# Altium project CanNode.PrjPcb
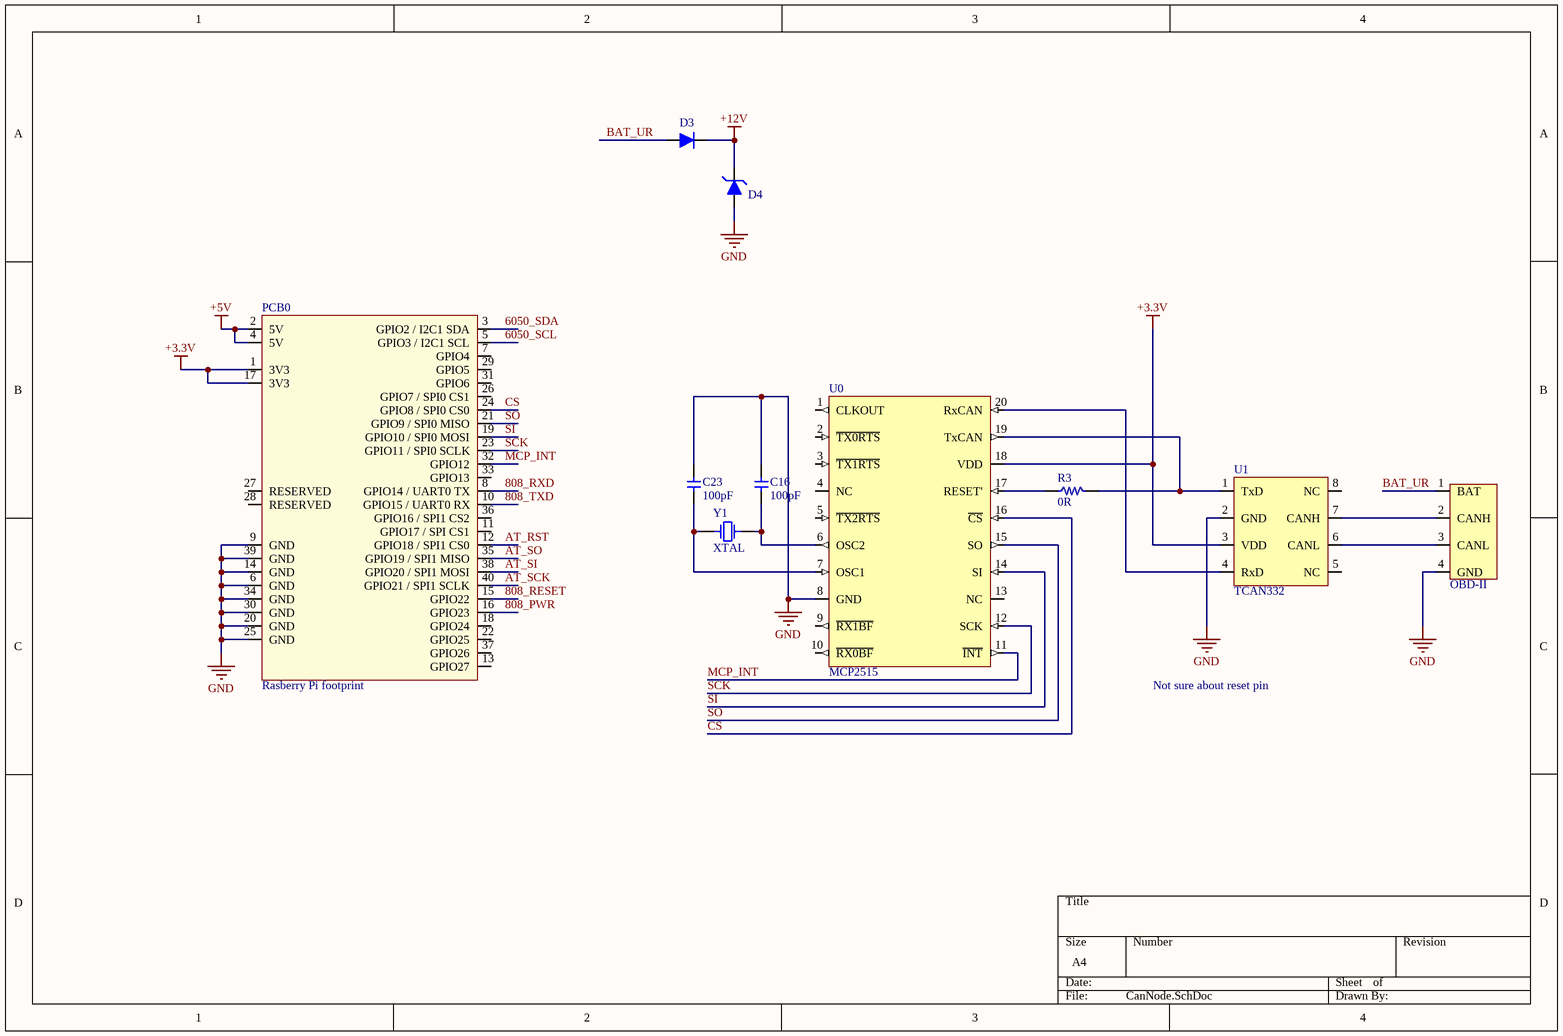
[diagram p0: CanNode.SchDoc]
6 sheets, 72 parts. Net scope: global (net labels, ports and power ports of the same name join across sheets).
Board files: mainPCB_24V.PcbDoc, mainPCB.PcbDoc
Sheets:
  CanNode.SchDoc
  MPU6050.SchDoc
  SIM808.SchDoc
  ATtiny.SchDoc
  bmp280_i2c.SchDoc
  PowerCircuit_24V.SchDoc

## Sheet CanNode.SchDoc
size A4

### Parts
C16  value 100pF  [0805]  (hidden comment: Generic Capacitor)
C23  value 100pF  [0805]  (hidden comment: Generic Capacitor)
D3  RSX301L-30TE25  [SMA_diode]  (value not drawn)
D4  TVS Diode  [TVS Diode 15]  (value not drawn)
OBD-II  OBD-II  [OBD_II]  (value not drawn)
PCB0  Rasberry Pi footprint  [Rasberry PI]
R3  value 0R  [0805]  (hidden comment: Resistor)
U0  MCP2515  Notes: Not sure about reset pin  [MCP2515]
U1  TCAN332  [SOIC-8]
Y1  XTAL  [XTAL-16.000]

### Nets
+3.3V: PCB0.1(3V3) PCB0.17(3V3) U0.18(VDD) U1.3(VDD)
+5V: PCB0.2(5V) PCB0.4(5V)
+12V: D3.2 D4.2
GND: C16.2 C23.2 D4.1 OBD-II.4(GND) PCB0.6(GND) PCB0.9(GND) PCB0.14(GND) PCB0.20(GND) PCB0.25(GND) PCB0.30(GND) PCB0.34(GND) PCB0.39(GND) U0.8(GND) U1.2(GND)
808_PWR: PCB0.16(GPIO23)
808_RESET: PCB0.15(GPIO22)
808_RXD: PCB0.8(GPIO14_/_UART0_TX)
808_TXD: PCB0.10(GPIO15_/_UART0_RX)
6050_SCL: PCB0.5(GPIO3_/_I2C1_SCL)
6050_SDA: PCB0.3(GPIO2_/_I2C1_SDA)
AT_RST: PCB0.12(GPIO18_/_SPI1_CS0)
AT_SCK: PCB0.40(GPIO21_/_SPI1_SCLK)
AT_SI: PCB0.38(GPIO20_/_SPI1_MOSI)
AT_SO: PCB0.35(GPIO19_/_SPI1_MISO)
BAT_UR: D3.1 OBD-II.1(BAT)
CS: PCB0.24(GPIO8_/_SPI0_CS0) U0.16(~{CS})
MCP_INT: PCB0.32(GPIO12) U0.11(~{INT})
SCK: PCB0.23(GPIO11_/_SPI0_SCLK) U0.12(SCK)
SI: PCB0.19(GPIO10_/_SPI0_MOSI) U0.14(SI)
SO: PCB0.21(GPIO9_/_SPI0_MISO) U0.15(SO)
NetC16_1: C16.1 U0.6(OSC2) Y1.1
NetC23_1: C23.1 U0.7(OSC1) Y1.0
NetOBD-II_2: OBD-II.2(CANH) U1.7(CANH)
NetOBD-II_3: OBD-II.3(CANL) U1.6(CANL)
NetR3_1: R3.1 U0.17(RESET')
NetR3_2: R3.2 U0.19(TxCAN) U1.1(TxD)
NetU0_20: U0.20(RxCAN) U1.4(RxD)

Not connected (* = marked no-connect by the designer): PCB0 7(GPIO4) 11(GPIO17_/_SPI_CS1) 13(GPIO27) 18(GPIO24) 22(GPIO25) 26(GPIO7_/_SPI0_CS1) 27(RESERVED) 28(RESERVED) 29(GPIO5) 31(GPIO6) 33(GPIO13) 36(GPIO16_/_SPI1_CS2) 37(GPIO26); U0 1(CLKOUT) 2(~{TX0RTS}) 3(~{TX1RTS}) 4(NC) 5(~{TX2RTS}) 9(~{RX1BF}) 10(~{RX0BF}) 13(NC); U1 5(NC) 8(NC)

### Library data of the parts
C16 C23 = Capacitor
D3 = RSX301L-30TE25: DIODE SCHOTTKY 30V 3A; Supplier: DigiKey; Supplier PN: RSX301L-30TE25CT-ND
D4 = SMBJ15D-M3/H: TVS DIODE 15VWM 24VC DO214AA; Manufacturer: Vishay Semiconductor Diodes Division; Type: Zener; Unidirectional Channels: 1; Voltage - Reverse Standoff (Typ): 15V; Voltage - Breakdown (Min): 17V; Voltage - Clamping (Max) @ Ipp: 24V; Current - Peak Pulse (10/1000µs): 25A; Power - Peak Pulse: 600W; Power Line Protection: No; Supplier 1: Digi-Key; Manufacturer Part Number: SMBJ15D-M3/H; Pricing 1: 1=0.51, 10=0.42, 25=0.3832, 100=0.2853, 250=0.25852 (CAD); Packaging: Cut Tape (CT); Part Status: Active; Bidirectional Channels: -; Applications: General Purpose; Capacitance @ Frequency: -; Operating Temperature: -55°C ~ 150°C (TJ); Mounting Type: Surface Mount; Package / Case: DO-214AA, SMB; Supplier Device Package: DO-214AA (SMBJ); ComponentLink1URL: http://www.vishay.com/docs/87606/87606.pdf; ComponentLink1Description: http://www.vishay.com/docs/87606/87606.pdf; Supplier Part Number 1: SMBJ15D-M3/HGICT-ND
PCB0 = Rasberry Pi
R3 = Resistor: Generic Resistor
U0 = MCP2515: IC CAN CTLR W/SPI 2.0B 20-QFN; Mfr 1: Microchip Technology; Digi-Key Part Number: MCP2515T-I/MLCT-ND
U1 = TCAN332: IC TXRX CAN 8SOIC; Mfr 1: Texas Instruments; Digi-Key Part Number: 296-43711-1-ND
Y1 = XTAL-16.000: XTAL16.0000MHZ 18PF SMD; Manufacturer: Abracon LLC; Manufacturer Part Number: ABM7-16.000MHZ-D2Y-T; Frequency: 16MHz; Frequency Stability: ±30ppm; Frequency Tolerance: ±20ppm; ESR (Equivalent Series Resistance): 50 Ohm; Operating Mode: Fundamental; Supplier 1: Digi-Key; Pricing 1: 1=1.12, 10=0.989, 50=0.9234, 100=0.8162, 500=0.77322 (CAD); Packaging: Cut Tape (CT); Part Status: Active; Type: MHz Crystal; Load Capacitance: 18pF; Operating Temperature: -40°C ~ 85°C; Ratings: -; Mounting Type: Surface Mount; Package / Case: 2-SMD, No Lead; Size / Dimension: 0.236" L x 0.138" W (6.00mm x 3.50mm); Height - Seated (Max): 0.055" (1.40mm); ComponentLink1URL: http://www.abracon.com/Resonators/abm7.pdf; ComponentLink1Description: http://www.abracon.com/Resonators/abm7.pdf; Supplier Part Number 1: 535-9840-1-ND

## Sheet MPU6050.SchDoc
size A4
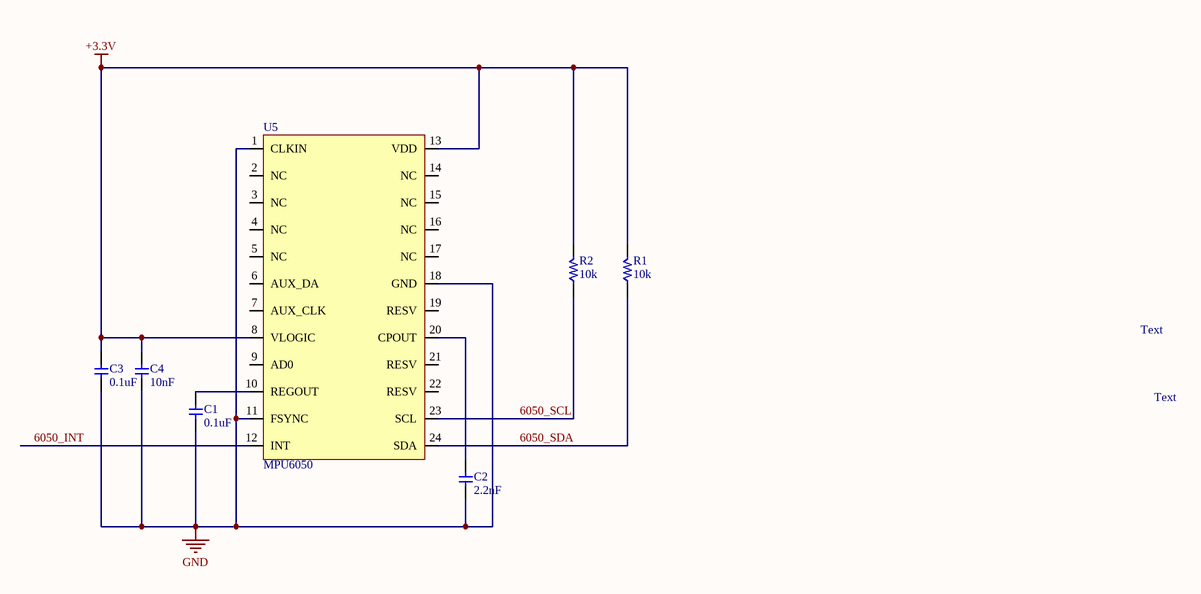
[diagram p1: MPU6050.SchDoc]

### Parts
C1  value 0.1uF  [0805]  (hidden comment: Generic Capacitor)
C2  value 2.2nF  [0805]  (hidden comment: Generic Capacitor)
C3  value 0.1uF  [0805]  (hidden comment: Generic Capacitor)
C4  value 10nF  [0805]  (hidden comment: Generic Capacitor)
R1  value 10k  [0805]  (hidden comment: Resistor)
R2  value 10k  [0805]  (hidden comment: Resistor)
U5  MPU6050  [MPU-6050]

### Nets
+3.3V: C3.1 C4.2 R1.2 R2.2 U5.8(VLOGIC) U5.13(VDD)
GND: C1.1 C2.1 C3.2 C4.1 U5.1(CLKIN) U5.11(FSYNC) U5.18(GND)
6050_INT: U5.12(INT)
6050_SCL: R2.1 U5.23(SCL)
6050_SDA: R1.1 U5.24(SDA)
NetC1_2: C1.2 U5.10(REGOUT)
NetC2_2: C2.2 U5.20(CPOUT)

Not connected (* = marked no-connect by the designer): U5 2(NC) 3(NC) 4(NC) 5(NC) 6(AUX_DA) 7(AUX_CLK) 9(AD0) 14(NC) 15(NC) 16(NC) 17(NC) 19(RESV) 21(RESV) 22(RESV)

### Notes on the sheet
- Text

### Library data of the parts
C1-C4 = Capacitor
R1 R2 = Resistor: Generic Resistor
U5 = MPU6050: IMU ACCEL/GYRO 3-AXIS I2C 24QFN; Notes: *

## Sheet SIM808.SchDoc
size A4
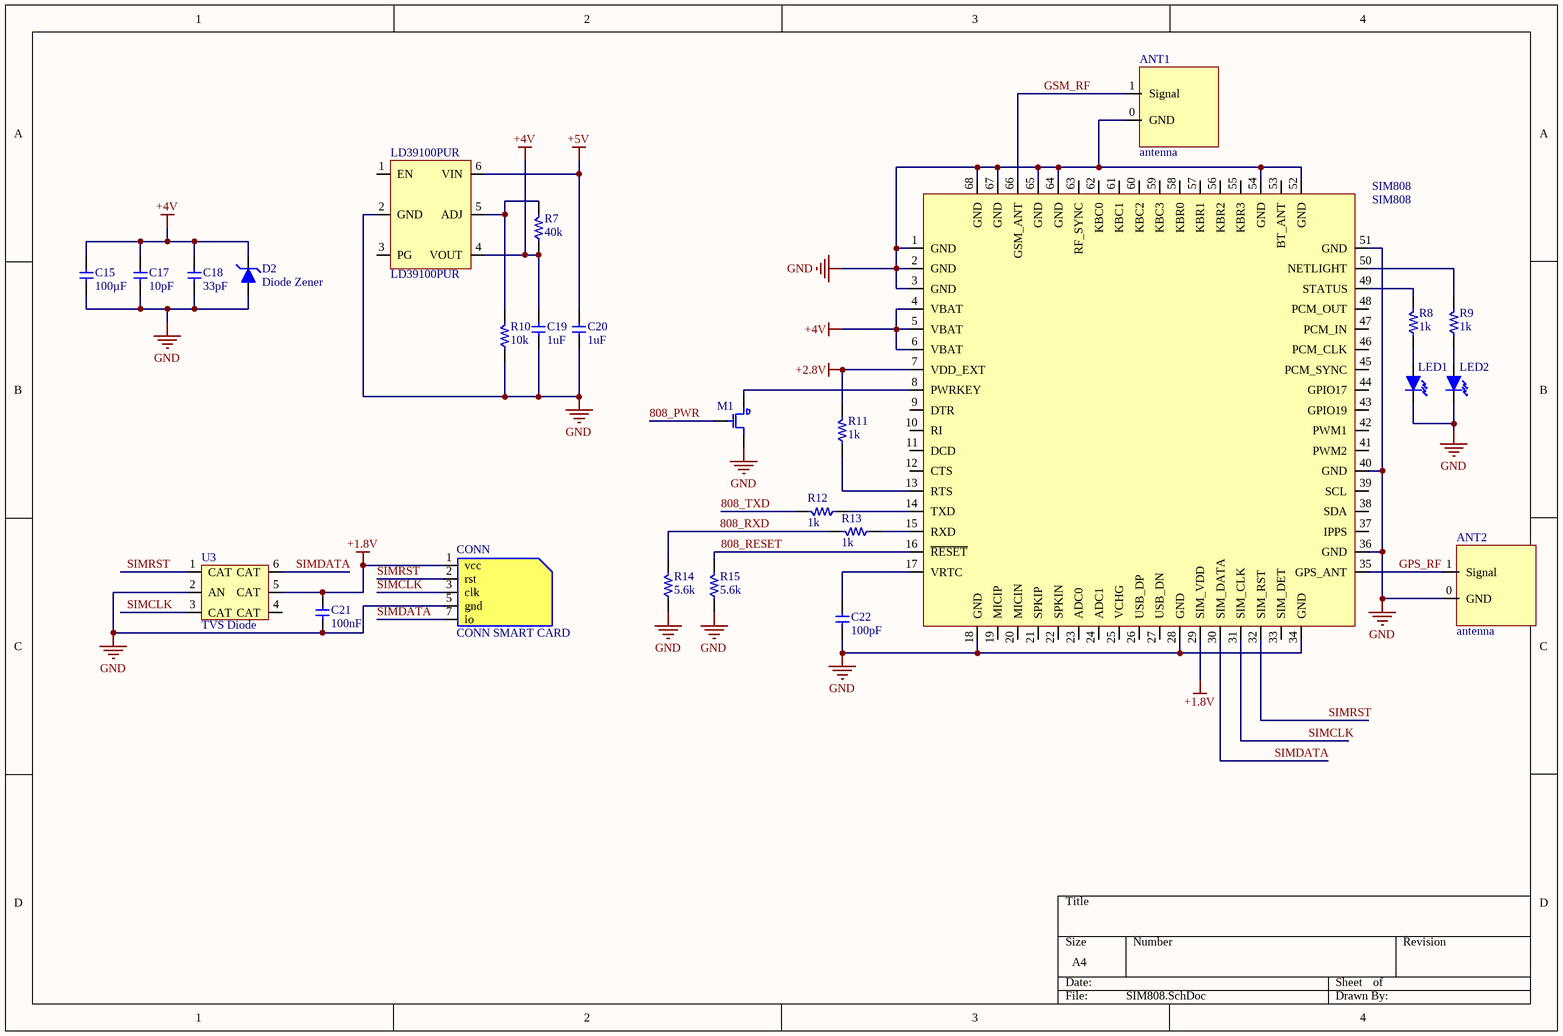
[diagram p2: SIM808.SchDoc]

### Parts
ANT1  antenna  [uFL]
ANT2  antenna  [uFL]
C15  Capacitance: 100µF  [Cap 1210]  (hidden comment: Cap Cer 100uF)
C17  value 10pF  [0805]  (hidden comment: Generic Capacitor)
C18  value 33pF  [0805]  (hidden comment: Generic Capacitor)
C19  value 1uF  [0805]  (hidden comment: Generic Capacitor)
C20  value 1uF  [0805]  (hidden comment: Generic Capacitor)
C21  value 100nF  [0805]  (hidden comment: Generic Capacitor)
C22  value 100pF  [0805]  (hidden comment: Generic Capacitor)
CONN  CONN SMART CARD  [CONN SMART CARD]
D2  Diode Zener  [Diode Zener]
LD39100PUR  LD39100PUR  [LD39100PUR]
LED1  Led Red  [0805 LED]  (value not drawn)
LED2  Led Green  [0805 LED]  (value not drawn)
M1  N-CH Mosfet Switch  [SOT32-3]  (value not drawn)
R7  value 40k  [0805]  (hidden comment: Resistor)
R8  value 1k  [0805]  (hidden comment: Resistor)
R9  value 1k  [0805]  (hidden comment: Resistor)
R10  value 10k  [0805]  (hidden comment: Resistor)
R11  value 1k  [0805]  (hidden comment: Resistor)
R12  value 1k  [0805]  (hidden comment: Resistor)
R13  value 1k  [0805]  (hidden comment: Resistor)
R14  value 5.6k  [0805]  (hidden comment: Resistor)
R15  value 5.6k  [0805]  (hidden comment: Resistor)
SIM808  SIM808  [SIM808]
U3  TVS Diode  [SMF05CT2G]

### Nets
+1.8V: C21.1 CONN.1(vcc) SIM808.29(SIM_VDD) U3.5(CAT)
+2.8V: R11.2 SIM808.7(VDD_EXT)
+4V: C15.1 C17.1 C18.1 C19.2 D2.1 LD39100PUR.4(VOUT) R7.1 SIM808.4(VBAT) SIM808.5(VBAT) SIM808.6(VBAT)
+5V: C20.1 LD39100PUR.6(VIN)
GND: ANT1.0(GND) ANT2.0(GND) C15.2 C17.2 C18.2 C19.1 C20.2 C21.2 C22.2 CONN.5(gnd) D2.2 LD39100PUR.2(GND) LED1.1 LED2.1 M1.2(S) R10.1 R14.1 R15.1 SIM808.1(GND) SIM808.2(GND) SIM808.3(GND) SIM808.18(GND) SIM808.28(GND) SIM808.34(GND) SIM808.36(GND) SIM808.40(GND) SIM808.51(GND) SIM808.52(GND) SIM808.54(GND) SIM808.64(GND) SIM808.65(GND) SIM808.67(GND) SIM808.68(GND) U3.2(AN)
808_PWR: M1.1(G)
808_RESET: R15.2 SIM808.16(~{RESET})
808_RXD: R13.2 R14.2
808_TXD: R12.2
GPS_RF: ANT2.1(Signal) SIM808.35(GPS_ANT)
GSM_RF: ANT1.1(Signal) SIM808.66(GSM_ANT)
SIMCLK: CONN.3(clk) SIM808.31(SIM_CLK) U3.3(CAT)
SIMDATA: CONN.7(io) SIM808.30(SIM_DATA) U3.6(CAT)
SIMRST: CONN.2(rst) SIM808.32(SIM_RST) U3.1(CAT)
NetC22_1: C22.1 SIM808.17(VRTC)
NetLD39100PUR_5: LD39100PUR.5(ADJ) R7.2 R10.2
NetLED1_2: LED1.2 R8.1
NetLED2_2: LED2.2 R9.1
NetM1_3: M1.3(D) SIM808.8(PWRKEY)
NetR8_2: R8.2 SIM808.49(STATUS)
NetR9_2: R9.2 SIM808.50(NETLIGHT)
NetR11_1: R11.1 SIM808.13(RTS)
NetR12_1: R12.1 SIM808.14(TXD)
NetR13_1: R13.1 SIM808.15(RXD)

Not connected (* = marked no-connect by the designer): LD39100PUR 1(EN) 3(PG); SIM808 9(DTR) 10(RI) 11(DCD) 12(CTS) 19(MICIP) 20(MICIN) 21(SPKIP) 22(SPKIN) 23(ADC0) 24(ADC1) 25(VCHG) 26(USB_DP) 27(USB_DN) 33(SIM_DET) 37(IPPS) 38(SDA) 39(SCL) 41(PWM2) 42(PWM1) 43(GPIO19) 44(GPIO17) 45(PCM_SYNC) 46(PCM_CLK) 47(PCM_IN) 48(PCM_OUT) 53(BT_ANT) 55(KBR3) 56(KBR2) 57(KBR1) 58(KBR0) 59(KBC3) 60(KBC2) 61(KBC1) 62(KBC0) 63(RF_SYNC); U3 4(CAT)

### Library data of the parts
ANT1 ANT2 = antenna: uFL SMT Antenna Connector; mfr: adafruit; supplier: https://www.adafruit.com/product/1661
C15 = LMK325ABJ107MM-P: CAP CER 100UF 10V X5R 1210; Manufacturer: Taiyo Yuden; Tolerance: ±20%; Supplier 1: Digi-Key; Manufacturer Part Number: LMK325ABJ107MM-P; Pricing 1: 1=1.55, 10=1.231, 25=1.1284, 50=1.0668, 100=0.9231, 250=0.82052, 500=0.69746 (CAD); Packaging: Cut Tape (CT); Part Status: Active; Voltage - Rated: 10V; Temperature Coefficient: X5R; Operating Temperature: -55°C ~ 85°C; Features: -; Ratings: -; Applications: General Purpose; Mounting Type: Surface Mount, MLCC; Package / Case: 1210 (3225 Metric); Size / Dimension: 0.126" L x 0.098" W (3.20mm x 2.50mm); Height - Seated (Max): -; Thickness (Max): 0.110" (2.80mm); Lead Spacing: -; Lead Style: -; ComponentLink1URL: http://ds.yuden.co.jp/TYCOMPAS/ut/detail.do?productNo=LMK325ABJ107MM-P&fileName=LMK325ABJ107MM-P_SS&mode=specSheetDownload; ComponentLink1Description: http://ds.yuden.co.jp/TYCOMPAS/ut/detail.do?productNo=LMK325ABJ107MM-P&fileName=LMK325ABJ107MM-P_SS&mode=specSheetDownload; Supplier Part Number 1: 587-4317-1-ND
C17-C22 = Capacitor
CONN = CONN SMART CARD: Manufacturer: Wurth Electronics Inc; Manufacturer Part Number: 693022010811; Card Type: Micro SIM; Number of Positions: 8; Connector Type: Connector and Ejector; Insertion, Removal Method: Hinged Lid; Supplier 1: Digi-Key; Pricing 1: 1=2.6, 10=2.384, 50=2.2076, 100=2.0317, 500=1.76614 (CAD); Packaging: Cut Tape (CT); Part Status: Active; Ejector Side: -; Mounting Type: Surface Mount, Right Angle; Features: Shielded; Height Above Board: 0.077" (1.95mm); Mounting Feature: Normal, Standard - Top; Contact Finish: Gold; Contact Finish Thickness: -; ComponentLink1URL: http://katalog.we-online.de/em/datasheet/693022010811.pdf; ComponentLink1Description: http://katalog.we-online.de/em/datasheet/693022010811.pdf; Supplier Part Number 1: 732-5957-1-ND
D2 = MMSZ5231BT1G: DIODE ZENER 5.1V 500MW SOD123; Manufacturer: ON Semiconductor; Tolerance: ±5%; Impedance (Max) (Zzt): 17 Ohm; Current - Reverse Leakage @ Vr: 5µA @ 2V; Voltage - Forward (Vf) (Max) @ If: 900mV @ 10mA; Supplier 1: Digi-Key; Manufacturer Part Number: MMSZ5231BT1G; Pricing 1: 1=0.34, 10=0.282, 100=0.149, 500=0.09802, 1000=0.06666 (CAD); Packaging: Cut Tape (CT); Part Status: Active; Voltage - Zener (Nom) (Vz): 5.1V; Power - Max: 500mW; Operating Temperature: -55°C ~ 150°C; Mounting Type: Surface Mount; Package / Case: SOD-123; Supplier Device Package: SOD-123; ComponentLink1URL: http://www.onsemi.com/pub_link/Collateral/MMSZ5221BT1-D.PDF; ComponentLink1Description: http://www.onsemi.com/pub_link/Collateral/MMSZ5221BT1-D.PDF; Supplier Part Number 1: MMSZ5231BT1GOSCT-ND
LD39100PUR = LD39100PUR: Adjustable linear voltage regulator; mfr: ST; supplier: http://www.digikey.ca/product-detail/en/stmicroelectronics/LD39100PUR/497-11013-1-ND/2524221
LED1 = LTST-C171EKT: LED RED CLEAR 0805 SMD; Manufacturer: Lite-On Inc.; Lens Color: Colorless; Millicandela Rating: 6mcd; Lens Style/Size: Rectangle with Flat Top, 1.40mm x 1.25mm; Voltage - Forward (Vf) (Typ): 2V; Current - Test: 20mA; Viewing Angle: 130°; Wavelength - Dominant: 621nm; Wavelength - Peak: 630nm; Supplier 1: Digi-Key; Manufacturer Part Number: LTST-C171EKT; Pricing 1: 1=0.48, 10=0.351, 25=0.2588, 100=0.1848, 250=0.12564, 500=0.11086, 1000=0.08684 (CAD); Packaging: Cut Tape (CT); Part Status: Active; Color: Red; Lens Transparency: Clear; Mounting Type: Surface Mount; Features: -; Package / Case: 0805 (2012 Metric); Supplier Device Package: Chip LED; Size / Dimension: 2.00mm L x 1.25mm W; Height (Max): 0.80mm; ComponentLink1URL: http://media.digikey.com/pdf/Data%20Sheets/Lite-On%20PDFs/LTST-C171EKT.pdf; ComponentLink1Description: http://media.digikey.com/pdf/Data%20Sheets/Lite-On%20PDFs/LTST-C171EKT.pdf; Supplier Part Number 1: 160-1422-1-ND
LED2 = LTST-C170GKT: LED GREEN CLEAR 0805 SMD; Manufacturer: Lite-On Inc.; Lens Color: Colorless; Millicandela Rating: 6mcd; Lens Style/Size: Rectangle with Flat Top, 1.40mm x 1.25mm; Voltage - Forward (Vf) (Typ): 2.1V; Current - Test: 10mA; Viewing Angle: 130°; Wavelength - Dominant: 569nm; Wavelength - Peak: 565nm; Supplier 1: Digi-Key; Manufacturer Part Number: LTST-C170GKT; Pricing 1: 1=0.48, 10=0.351, 25=0.2588, 100=0.1848, 250=0.12564, 500=0.11086, 1000=0.08684 (CAD); Packaging: Cut Tape (CT); Part Status: Active; Color: Green; Lens Transparency: Clear; Mounting Type: Surface Mount; Features: -; Package / Case: 0805 (2012 Metric); Supplier Device Package: -; Size / Dimension: 2.00mm L x 1.25mm W; Height (Max): 1.10mm; ComponentLink1URL: http://media.digikey.com/pdf/Data%20Sheets/Lite-On%20PDFs/LTST-C170GKT.pdf; ComponentLink1Description: http://media.digikey.com/pdf/Data%20Sheets/Lite-On%20PDFs/LTST-C170GKT.pdf; Supplier Part Number 1: 160-1179-1-ND
M1 = BSH105,215: MOSFET N-CH 20V 1.05A SOT23; Manufacturer: NXP USA Inc.; FET Type: N-Channel; Current - Continuous Drain (Id) @ 25°C: 1.05A (Ta); Drive Voltage (Max Rds On,  Min Rds On): 1.8V, 4.5V; Vgs(th) (Max) @ Id: 570mV @ 1mA; Gate Charge (Qg) (Max) @ Vgs: 3.9nC @ 4.5V; Input Capacitance (Ciss) (Max) @ Vds: 152pF @ 16V; Vgs (Max): ±8V; Power Dissipation (Max): 417mW (Ta); Rds On (Max) @ Id, Vgs: 200 mOhm @ 600mA, 4.5V; Supplier 1: Digi-Key; Manufacturer Part Number: BSH105,215; Pricing 1: 1=0.53, 10=0.425, 100=0.2902, 500=0.21758, 1000=0.16318 (CAD); Packaging: Cut Tape (CT); Part Status: Active; Technology: MOSFET (Metal Oxide); Drain to Source Voltage (Vdss): 20V; FET Feature: -; Operating Temperature: -55°C ~ 150°C (TJ); Mounting Type: Surface Mount; Supplier Device Package: TO-236AB (SOT23); Package / Case: TO-236-3, SC-59, SOT-23-3; ComponentLink1URL: http://www.nxp.com/documents/data_sheet/BSH105.pdf; ComponentLink1Description: http://www.nxp.com/documents/data_sheet/BSH105.pdf; Supplier Part Number 1: 568-6215-1-ND
R7-R15 = Resistor: Generic Resistor
SIM808 = SIM808: SIM808 GSM + GPRS + GPS Cellular Module; Mfr: SimCom; Supplier: http://www.ebay.ca/itm/291879777454?_trksid=p2057872.m2749.l2649&ssPageName=STRK%3AMEBIDX%3AIT
U3 = SMF05CT2G: TVS DIODE 5VWM 12.5VC SOT363; Manufacturer: ON Semiconductor; Unidirectional Channels: 5; Voltage - Reverse Standoff (Typ): 5V (Max); Voltage - Breakdown (Min): 6.2V; Voltage - Clamping (Max) @ Ipp: 12.5V; Current - Peak Pulse (10/1000µs): 8A (8/20µs); Power - Peak Pulse: 100W; Power Line Protection: No; Capacitance @ Frequency: 80pF @ 1MHz; Supplier 1: Digi-Key; Manufacturer Part Number: SMF05CT2G; Pricing 1: 1=0.53, 10=0.424, 100=0.2891, 500=0.21684, 1000=0.16262 (CAD); Packaging: Cut Tape (CT); Part Status: Active; Type: Zener; Bidirectional Channels: -; Applications: Automotive; Operating Temperature: -40°C ~ 125°C (TJ); Mounting Type: Surface Mount; Package / Case: 6-TSSOP, SC-88, SOT-363; Supplier Device Package: SC-88/SC70-6/SOT-363; ComponentLink1URL: http://www.onsemi.com/pub_link/Collateral/SMF05C-D.PDF; ComponentLink1Description: http://www.onsemi.com/pub_link/Collateral/SMF05C-D.PDF; Supplier Part Number 1: SMF05CT2GOSCT-ND

## Sheet ATtiny.SchDoc
size A4
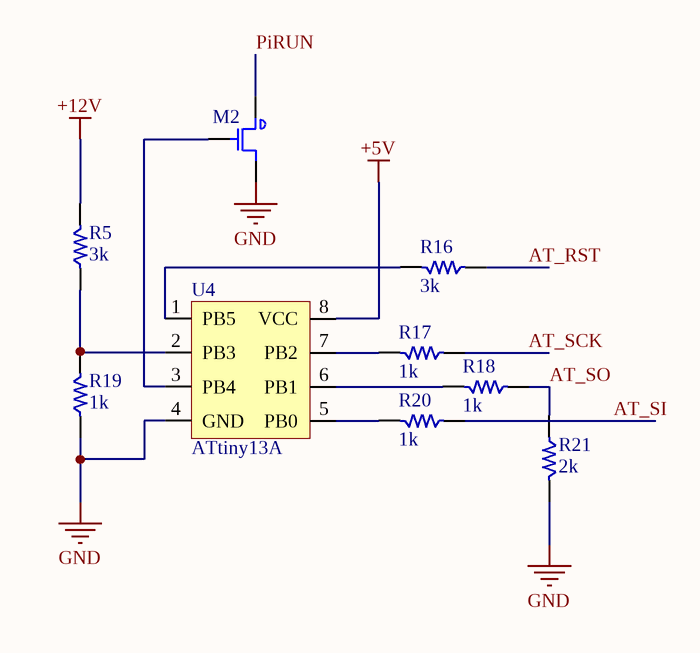
[diagram p3: ATtiny.SchDoc]

### Parts
M2  N-CH Mosfet Switch  [SOT32-3]  (value not drawn)
R5  value 3k  [0805]  (hidden comment: Resistor)
R16  value 3k  [0805]  (hidden comment: Resistor)
R17  value 1k  [0805]  (hidden comment: Resistor)
R18  value 1k  [0805]  (hidden comment: Resistor)
R19  value 1k  [0805]  (hidden comment: Resistor)
R20  value 1k  [0805]  (hidden comment: Resistor)
R21  value 2k  [0805]  (hidden comment: Resistor)
U4  ATtiny13A  [ATtiny13A]

### Nets
+5V: U4.8(VCC)
+12V: R5.2
GND: M2.2(S) R19.1 R21.2 U4.4(GND)
AT_RST: R16.1
AT_SCK: R17.1
AT_SI: R20.1
AT_SO: R18.1 R21.1
PiRUN: M2.3(D)
NetM2_1: M2.1(G) U4.3(PB4)
NetR5_1: R5.1 R19.2 U4.2(PB3)
NetR16_2: R16.2 U4.1(PB5)
NetR17_2: R17.2 U4.7(PB2)
NetR18_2: R18.2 U4.6(PB1)
NetR20_2: R20.2 U4.5(PB0)

### Library data of the parts
M2 = BSH105,215: as M1 on sheet SIM808; Supplier 1: Digi-Key; Manufacturer Part Number: BSH105,215; Pricing 1: 1=0.53, 10=0.425, 100=0.2902, 500=0.21758, 1000=0.16318 (CAD); Packaging: Cut Tape (CT); Part Status: Active; Technology: MOSFET (Metal Oxide); Drain to Source Voltage (Vdss): 20V; FET Feature: -; Operating Temperature: -55°C ~ 150°C (TJ); Mounting Type: Surface Mount; Supplier Device Package: TO-236AB (SOT23); Package / Case: TO-236-3, SC-59, SOT-23-3; ComponentLink1URL: http://www.nxp.com/documents/data_sheet/BSH105.pdf; ComponentLink1Description: http://www.nxp.com/documents/data_sheet/BSH105.pdf; Supplier Part Number 1: 568-6215-1-ND
R5 R16-R21 = Resistor: Generic Resistor
U4 = ATtiny13A: Manufacturer: Microchip Technology; Manufacturer Part Number: ATTINY13A-SSU; Core Processor: AVR; Core Size: 8-Bit; Speed: 20MHz; Peripherals: Brown-out Detect/Reset, POR, PWM, WDT; Number of I/O: 6; Program Memory Size: 1KB (512 x 16); Program Memory Type: FLASH; EEPROM Size: 64 x 8; Voltage - Supply (Vcc/Vdd): 1.8 V ~ 5.5 V; Data Converters: A/D 4x10b; Oscillator Type: Internal; Supplier 1: Digi-Key; Pricing 1: 1=0.89, 25=0.8096, 100=0.7319 (CAD); Packaging: Tube; Part Status: Active; Connectivity: -; RAM Size: 64 x 8; Operating Temperature: -40°C ~ 85°C (TA); Package / Case: 8-SOIC (0.154", 3.90mm Width); Supplier Device Package: 8-SOIC; ComponentLink1URL: http://ww1.microchip.com/downloads/en/devicedoc/8126s.pdf; ComponentLink1Description: http://ww1.microchip.com/downloads/en/devicedoc/8126s.pdf; Supplier Part Number 1: ATTINY13A-SSU-ND

## Sheet bmp280_i2c.SchDoc
size A4
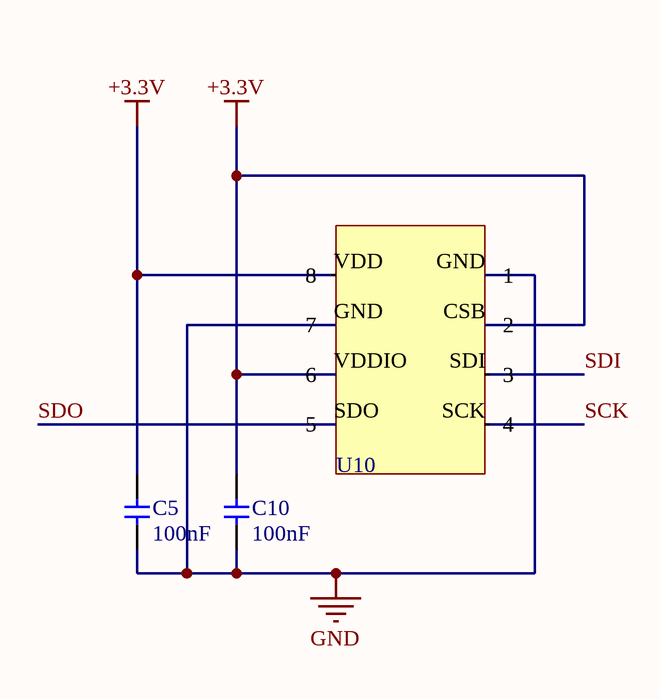
[diagram p4: bmp280_i2c.SchDoc]

### Parts
C5  value 100nF  [0805]  (hidden comment: Generic Capacitor)
C10  value 100nF  [0805]  (hidden comment: Generic Capacitor)
U10  BMP280  [bmp280_i2c]  (value not drawn)

### Nets
+3.3V: C5.1 C10.1 U10.CSB(2) U10.VDD(8) U10.VDDIO(6)
GND: C5.2 C10.2 U10.GND(7)
SCK: U10.SCK(4)
SDI: U10.SDI(3)
SDO: U10.SDO(5)

### Library data of the parts
C5 C10 = Capacitor

## Sheet PowerCircuit_24V.SchDoc
size A4
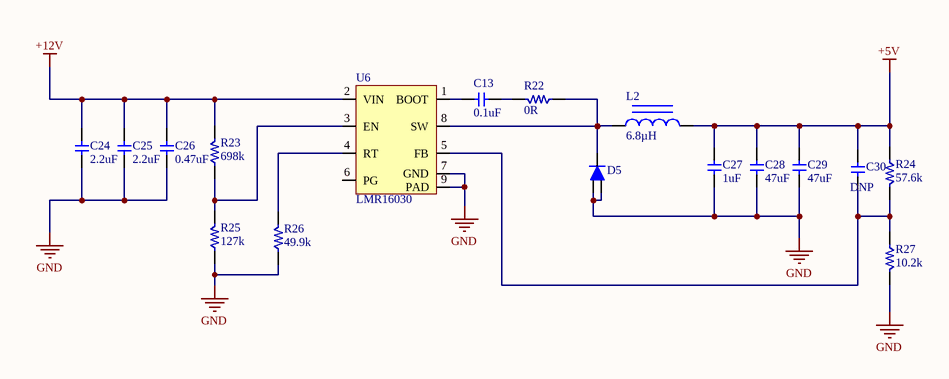
[diagram p5: PowerCircuit_24V.SchDoc]

### Parts
C13  value 0.1uF  [0603]  (hidden comment: Generic Capacitor)
C24  value 2.2uF  [Cap 1210]  (hidden comment: Generic Capacitor)
C25  value 2.2uF  [Cap 1210]  (hidden comment: Generic Capacitor)
C26  value 0.47uF  [0805]  (hidden comment: Generic Capacitor)
C27  value 1uF  [0805]  (hidden comment: Generic Capacitor)
C28  value 47uF  [Cap 1210]  (hidden comment: Generic Capacitor)
C29  value 47uF  [Cap 1210]  (hidden comment: Generic Capacitor)
C30  Digikey: DNP  [0603]  (hidden comment: Generic Capacitor)
D5  DIODE SCHOTTKY 60V 5A  [TO277A]  (value not drawn)
L2  Inductance: 6.8µH  [7447714068]  (hidden comment: FIXED IND 6.8UH 5.2A)
R22  value 0R  [0603]  (hidden comment: Resistor)
R23  value 698k  [0603]  (hidden comment: Resistor)
R24  value 57.6k  [0603]  (hidden comment: Resistor)
R25  value 127k  [0603]  (hidden comment: Resistor)
R26  value 49.9k  [0603]  (hidden comment: Resistor)
R27  value 10.2k  [0603]  (hidden comment: Resistor)
U6  LMR16030  [LMR16030]

### Nets
+5V: C27.1 C28.1 C29.1 C30.1 L2.0 R24.1
+12V: C24.1 C25.1 C26.1 R23.2 U6.2(VIN)
GND: C24.2 C25.2 C26.2 C27.2 C28.2 C29.2 D5.1 D5.2 R25.1 R26.1 R27.2 U6.7(GND) U6.9(PAD)
NetC13_1: C13.1 U6.1(BOOT)
NetC13_2: C13.2 R22.2
NetC30_2: C30.2 R24.2 R27.1 U6.5(FB)
NetD5_3: D5.3 L2.1 R22.1 U6.8(SW)
NetR23_1: R23.1 R25.2 U6.3(EN)
NetR26_2: R26.2 U6.4(RT)

Not connected (* = marked no-connect by the designer): U6 6(PG)

### Library data of the parts
C13 C24-C29 = Capacitor
  C13: Digikey: 490-1532-1-ND
  C24 C25: Digikey: 490-3385-1-ND
  C26: Digikey: 490-3326-1-ND
  C27: Digikey: 490-6484-1-ND
  C28 C29: Digikey: 490-3888-1-ND
C30 = Capacitor: Value: 27pF
D5 = SS5P6-M3/86A: DIODE SCHOTTKY 60V 5A TO277A; Manufacturer: Vishay Semiconductor Diodes Division; Voltage - Forward (Vf) (Max) @ If: 690mV @ 5A; Speed: Fast Recovery =< 500ns, > 200mA (Io); Current - Reverse Leakage @ Vr: 150µA @ 60V; Capacitance @ Vr, F: 200pF @ 4V, 1MHz; Supplier 1: Digi-Key; Manufacturer Part Number: SS5P6-M3/86A; Pricing 1: 1=0.92, 10=0.795, 25=0.7424, 100=0.5937, 250=0.55132, 500=0.4665 (CAD); Packaging: Cut Tape (CT); Part Status: Active; Diode Type: Schottky; Voltage - DC Reverse (Vr) (Max): 60V; Current - Average Rectified (Io): 5A; Reverse Recovery Time (trr): -; Mounting Type: Surface Mount; Package / Case: TO-277, 3-PowerDFN; Supplier Device Package: TO-277A (SMPC); Operating Temperature - Junction: -55°C ~ 150°C; ComponentLink1URL: http://www.vishay.com/docs/88988/ss5p6.pdf; ComponentLink1Description: http://www.vishay.com/docs/88988/ss5p6.pdf; Supplier Part Number 1: SS5P6-M3/86AGICT-ND
L2 = 7447714068: FIXED IND 6.8UH 5.2A 22 MOHM SMD; Manufacturer: Wurth Electronics Inc.; Type: Wirewound; Material - Core: Ferrite; Tolerance: ±30%; Current - Saturation: 5.8A; Shielding: Shielded; DC Resistance (DCR): 22 mOhm Max; Frequency - Self Resonant: 23.5MHz; Frequency - Test: 100kHz; Supplier 1: Digi-Key; Manufacturer Part Number: 7447714068; Pricing 1: 1=4.17, 10=3.651, 50=3.3904, 100=3.26, 250=3.12952 (CAD); Packaging: Cut Tape (CT); Part Status: Active; Current Rating: 5.2A; Q @ Freq: -; Ratings: -; Operating Temperature: -40°C ~ 125°C; Mounting Type: Surface Mount; Package / Case: Nonstandard; Supplier Device Package: -; Size / Dimension: 0.394" L x 0.394" W (10.00mm x 10.00mm); Height - Seated (Max): 0.197" (5.00mm); ComponentLink1URL: http://katalog.we-online.de/pbs/datasheet/7447714068.pdf; ComponentLink1Description: http://katalog.we-online.de/pbs/datasheet/7447714068.pdf; Supplier Part Number 1: 732-4108-1-ND
R22-R27 = Resistor: Generic Resistor
  R22: Digikey: 541-49.9HCT-ND
  R23: Digikey: 541-698KHCT-ND
  R24: Digikey: 541-57.6KHCT-ND
  R25: Digikey: 541-127KHCT-ND
  R26: Digikey: 541-49.9KHCT-ND
  R27: Digikey: 541-10.2KHCT-ND
U6 = LMR16030: IC REG BUCK ADJ 3A 8SOPWRPD; Manufacturer: Texas Instruments; Manufacturer Part Number: LMR16030PDDA; Function: Step-Down; Output Configuration: Positive; Output Type: Adjustable; Number of Outputs: 1; Voltage - Input (Min): 4.3V; Voltage - Input (Max): 60V; Voltage - Output (Min/Fixed): 0.8V; Voltage - Output (Max): 50V; Frequency - Switching: 200kHz ~ 2.5MHz; Synchronous Rectifier: No; Supplier 1: Digi-Key; Pricing 1: 1=8.44, 10=7.577, 100=6.2087, 500=5.28538, 1000=4.45755 (CAD); Packaging: Tube; Part Status: Active; Topology: Buck; Current - Output: 3A; Operating Temperature: -40°C ~ 125°C (TJ); Mounting Type: Surface Mount; Package / Case: 8-PowerSOIC (0.154", 3.90mm Width); Supplier Device Package: 8-SO PowerPad; ComponentLink1URL: http://www.ti.com/lit/ds/symlink/lmr16030.pdf; ComponentLink1Description: http://www.ti.com/lit/ds/symlink/lmr16030.pdf; Supplier Part Number 1: 296-44513-5-ND

## Nets that join several sheets
+3.3V: CanNode (PCB0.1 PCB0.17 U0.18 U1.3), MPU6050 (6 pins), bmp280_i2c (5 pins)
+5V: CanNode (PCB0.2 PCB0.4), SIM808 (C20.1 LD39100PUR.6), ATtiny (U4.8), PowerCircuit_24V (6 pins)
+12V: CanNode (D3.2 D4.2), ATtiny (R5.2), PowerCircuit_24V (5 pins)
GND: CanNode (14 pins), MPU6050 (7 pins), SIM808 (34 pins), ATtiny (M2.2 R19.1 R21.2 U4.4), bmp280_i2c (C5.2 C10.2 U10.GND), PowerCircuit_24V (13 pins)
808_PWR: CanNode (PCB0.16), SIM808 (M1.1)
808_RESET: CanNode (PCB0.15), SIM808 (R15.2 SIM808.16)
808_RXD: CanNode (PCB0.8), SIM808 (R13.2 R14.2)
808_TXD: CanNode (PCB0.10), SIM808 (R12.2)
6050_SCL: CanNode (PCB0.5), MPU6050 (R2.1 U5.23)
6050_SDA: CanNode (PCB0.3), MPU6050 (R1.1 U5.24)
AT_RST: CanNode (PCB0.12), ATtiny (R16.1)
AT_SCK: CanNode (PCB0.40), ATtiny (R17.1)
AT_SI: CanNode (PCB0.38), ATtiny (R20.1)
AT_SO: CanNode (PCB0.35), ATtiny (R18.1 R21.1)
SCK: CanNode (PCB0.23 U0.12), bmp280_i2c (U10.SCK)